# EAGLE schematic BiphasicBoard (EAGLE 6.5.0)
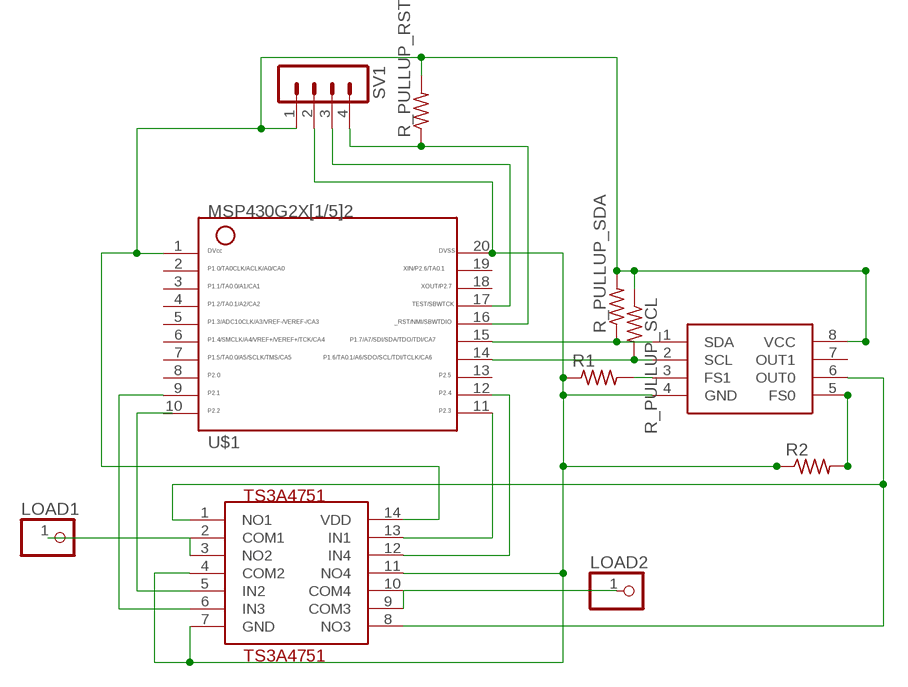
[diagram p0: schematic, sheet 1]

## Parts
DS4432  DS4432U+  [DS4432U+]
LOAD1  PINHD-1X1  [1X01]
LOAD2  PINHD-1X1  [1X01]
R1  R-US_R0603  [R0603]
R2  R-US_R0603  [R0603]
R_PULLUP_RST  R-US_R0603  [R0603]
R_PULLUP_SCL  R-US_R0603  [R0603]
R_PULLUP_SDA  R-US_R0603  [R0603]
SV1  MA04-1  [MA04-1]
TS3A4751  TS3A4751  [TS3A4751#2]
U$1  G2X[1/5]2---PW20  [PW20]

## Nets
_RST: R_PULLUP_RST.1 SV1.4 U$1.16
CURRENT0: DS4432.6(OUT0) TS3A4751.1(NO1) TS3A4751.8(NO3)
GND: DS4432.4(GND) R1.1 R2.1 SV1.2 TS3A4751.4(COM2) TS3A4751.7(GND) TS3A4751.11(NO4) U$1.20
LOAD1: LOAD1.1 TS3A4751.2(COM1) TS3A4751.3(NO2)
LOAD2: LOAD2.1 TS3A4751.9(COM3) TS3A4751.10(COM4)
N$1: DS4432.2(SCL) R_PULLUP_SCL.2 U$1.14
N$2: DS4432.1(SDA) R_PULLUP_SDA.1 U$1.15
N$4: TS3A4751.5(IN2) U$1.10
N$8: DS4432.5(FS0) R2.2
N$9: TS3A4751.6(IN3) U$1.9
N$10: TS3A4751.13(IN1) U$1.11
N$11: TS3A4751.12(IN4) U$1.12
TEST: SV1.3 U$1.17
VDD: DS4432.8(VCC) R_PULLUP_RST.2 R_PULLUP_SCL.1 R_PULLUP_SDA.2 SV1.1 TS3A4751.14(VDD) U$1.1
VIA1: DS4432.3(FS1) R1.2
Unconnected: DS4432.7(OUT1) U$1.2 U$1.3 U$1.4 U$1.5 U$1.6 U$1.7 U$1.8 U$1.13 U$1.18 U$1.19

## Library data of the parts
DS4432 = DS4432U+:DS4432U+: DS4432U+
LOAD1 LOAD2 = pinhead:PINHD-1X1: PIN HEADER
R1 R2 R_PULLUP_RST R_PULLUP_SCL R_PULLUP_SDA = resistor:R-US_: RESISTOR, American symbol
SV1 = con-lstb:MA04-1: PIN HEADER; OC_FARNELL: unknown; OC_NEWARK: unknown
TS3A4751 = TS3A4751:TS3A4751: TS3A4751
U$1 = TI_MSP430_v16:G2X[1/5]2---PW20: MSP430G2X[1/5]2 MSP430G2x52, MSP430G2x12 TSSOP (PW) 20 Pin Package http://focus.ti.com/docs/prod/folders/print/msp430g2452.html